# Altium schematic sheet p1_main_ac_dc.SchDoc
size A2; Organization: Protel International P/L; Address1: L3, 12a Rodborough Rd; Address2: Frenchs Forest; Address3: NSW; Address4: Australia 2086
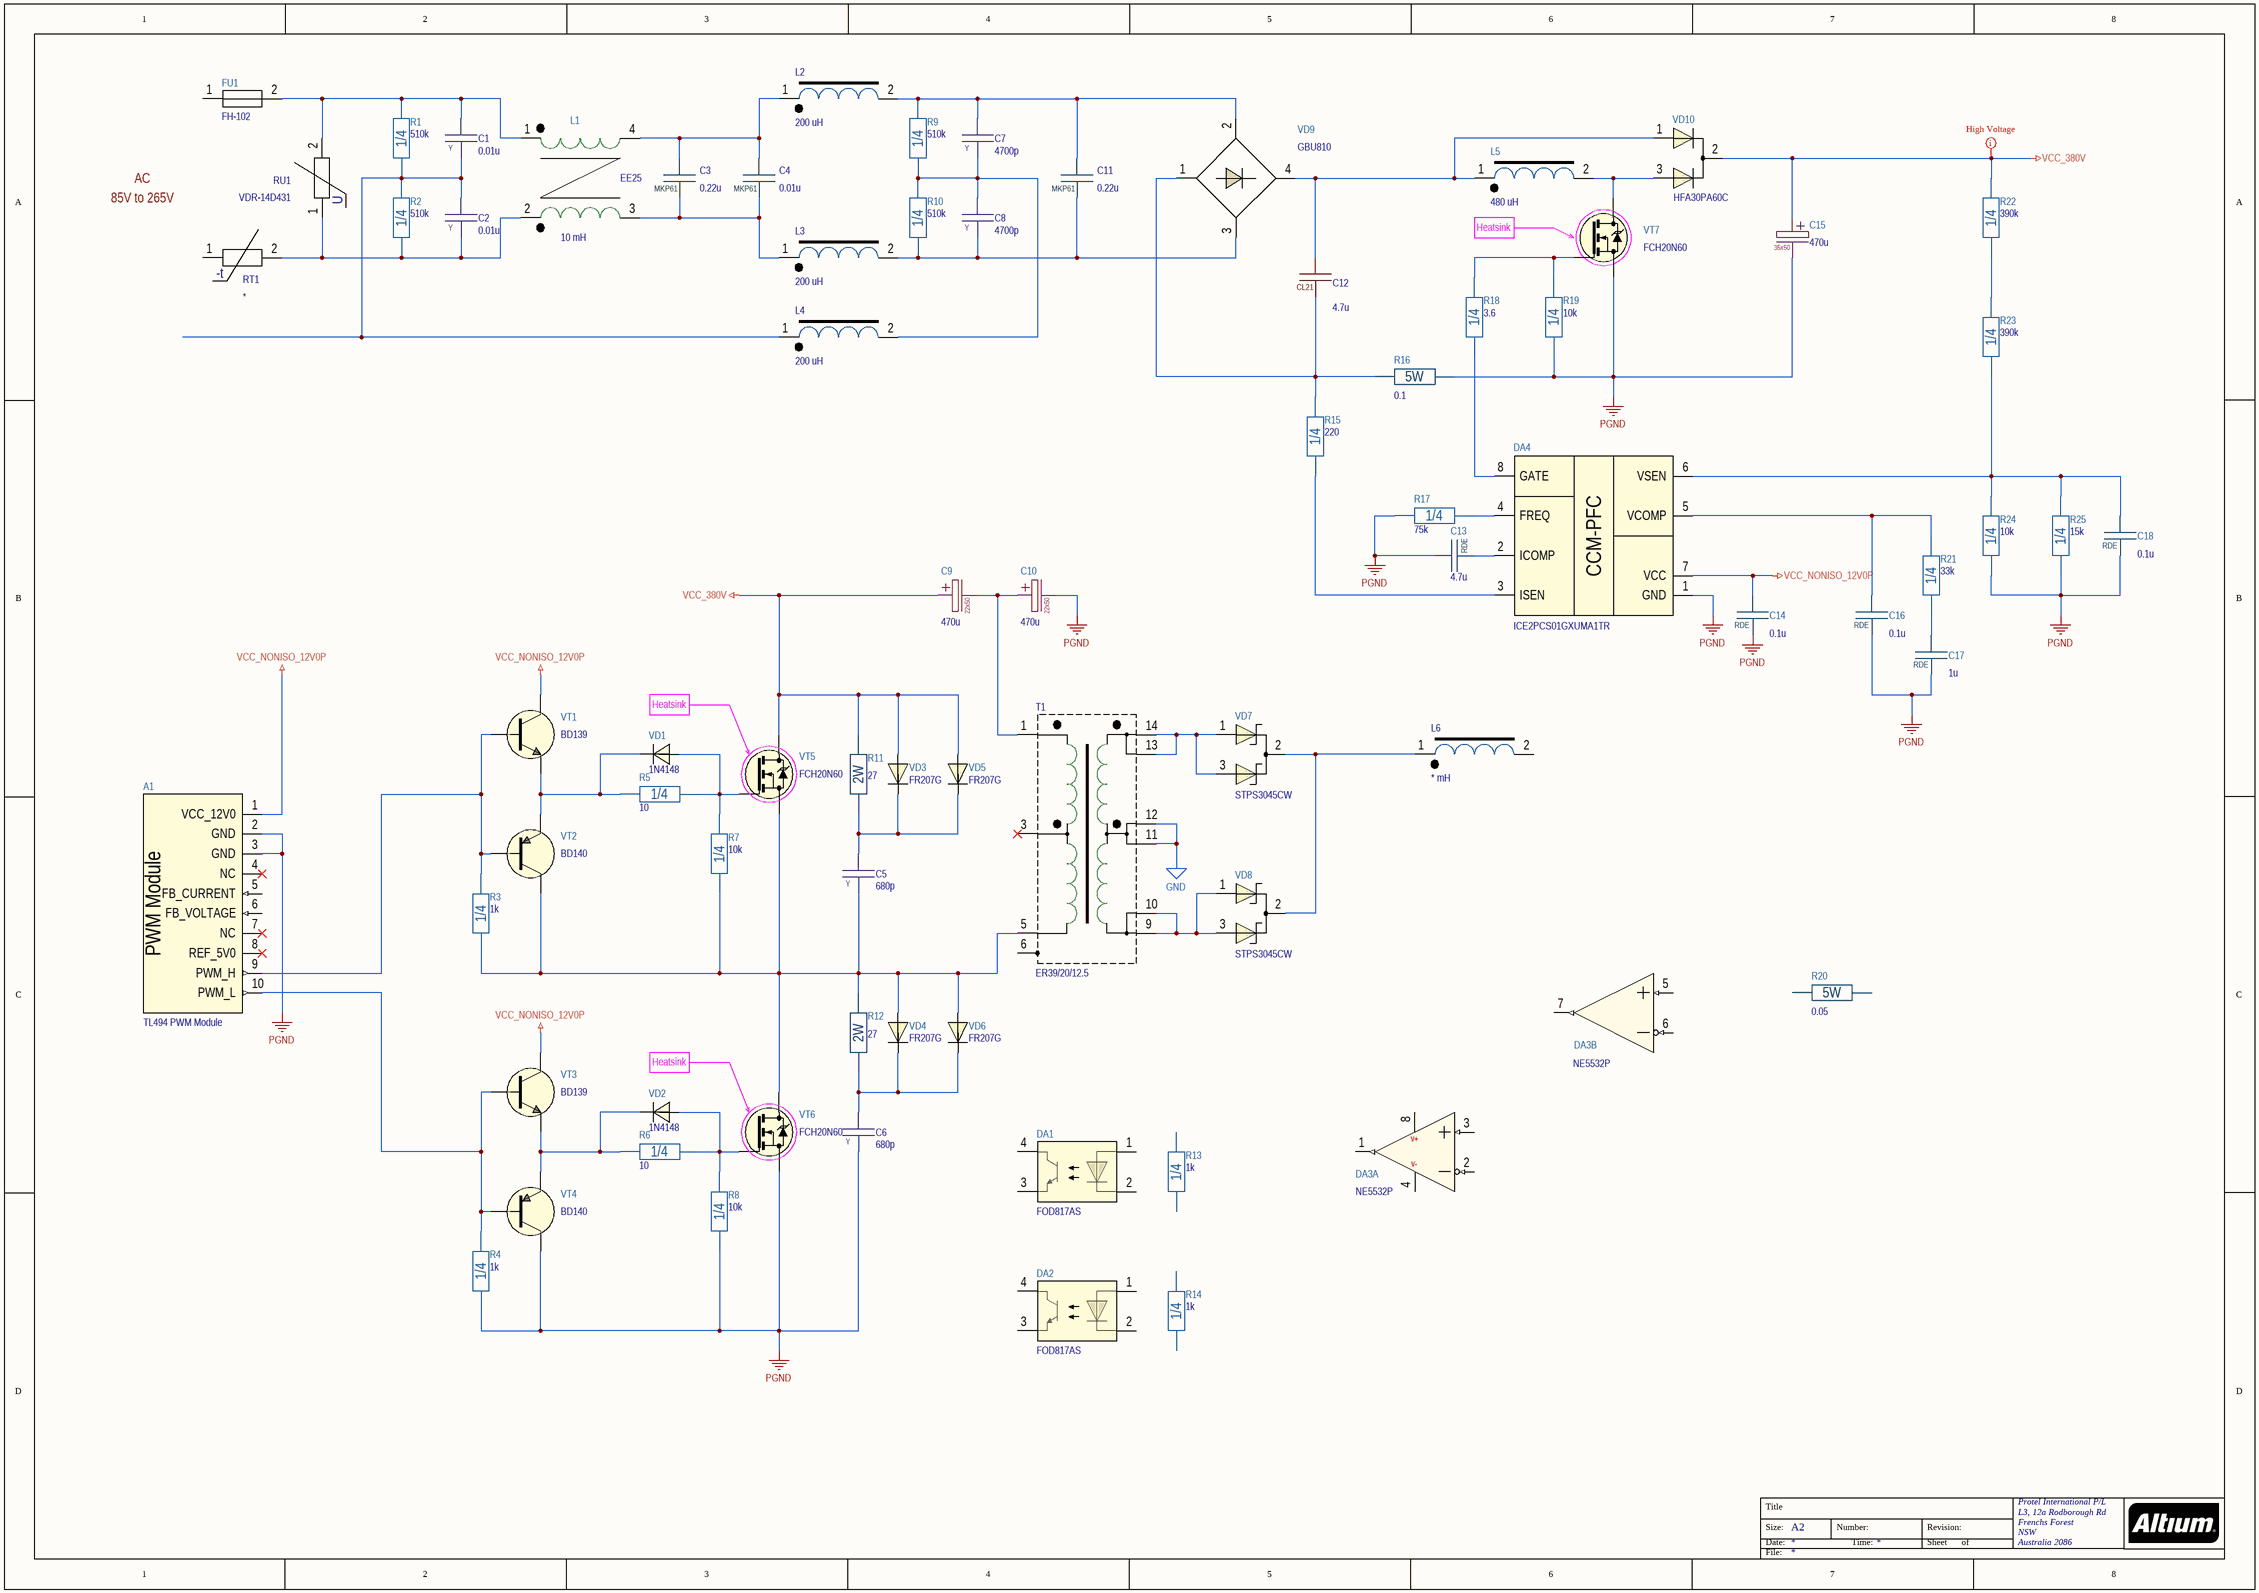
[diagram p0: p1_main_ac_dc.SchDoc]

## Parts
A1  TL494 PWM Module  [PWM-TL494]
C1  0.01u  Package: Y  [JYC_Y2_CAP_6.5]
C2  0.01u  Package: Y  [JYC_Y2_CAP_6.5]
C3  0.22u  [MKP61_18x14.5x8.5_P15]
C4  0.01u  [MKP61_18x12x6_P15]
C5  680p  Package: Y  [JYC_Y2_CAP_7.5]
C6  680p  Package: Y  [JYC_Y2_CAP_7.5]
C7  4700p  Package: Y  [JYC_Y2_CAP_6.5]
C8  4700p  Package: Y  [JYC_Y2_CAP_6.5]
C9  470u  Package: 22x50  [ECAP22X50X10]
C10  470u  Package: 22x50  [ECAP22X50X10]
C11  0.22u  [MKP61_18x14.5x8.5_P15]
C12  4.7u  [CL21_29x24.5x14.0_P27.5]
C13  4.7u  Package: RDE  [RDE_2P1]
C14  0.1u  Package: RDE  [RDE_1P1]
C15  470u  Package: 35x50  [ECAP35X50X10]
C16  0.1u  Package: RDE  [RDE_1P1]
C17  1u  Package: RDE  [RDE_2P1]
C18  0.1u  Package: RDE  [RDE_1P1]
DA1  FOD817AS  [N04C]
DA2  FOD817AS  [N04C]
DA3  NE5532P  [DIP-8P-M01]  (parts A,B of 2)
DA4  ICE2PCS01GXUMA1TR  [SOIC-8_with_DIP-8]
FU1  FH-102  [FH-102]
L1  10 mH  [EE25/10/6]
L2  200 uH  [CORE_D20_GB]
L3  200 uH  [CORE_D20_GB]
L4  200 uH  [CORE_D20_GB]
L5  480 uH  [CORE_D36_GB]
L6  * mH  [CORE_D33_GB]
R1  510k  Package: 1/4  [CFR-25]
R2  510k  Package: 1/4  [CFR-25]
R3  1k  Package: 1/4  [CFR-25]
R4  1k  Package: 1/4  [CFR-25]
R5  10  Package: 1/4  [CFR-25(VERTICAL)]
R6  10  Package: 1/4  [CFR-25(VERTICAL)]
R7  10k  Package: 1/4  [CFR-25]
R8  10k  Package: 1/4  [CFR-25]
R9  510k  Package: 1/4  [CFR-25]
R10  510k  Package: 1/4  [CFR-25]
R11  27  Package: 2W  [CFR-200]
R12  27  Package: 2W  [CFR-200]
R13  1k  Package: 1/4  [CFR-25]
R14  1k  Package: 1/4  [CFR-25]
R15  220  Package: 1/4  [CFR-25]
R16  0.1  Package: 5W  [BPR58]
R17  75k  Package: 1/4  [CFR-25]
R18  3.6  Package: 1/4  [CFR-25]
R19  10k  Package: 1/4  [CFR-25]
R20  0.05  Package: 5W  [BPR58]
R21  33k  Package: 1/4  [CFR-25]
R22  390k  Package: 1/4  [CFR-25]
R23  390k  Package: 1/4  [CFR-25]
R24  10k  Package: 1/4  [CFR-25]
R25  15k  Package: 1/4  [CFR-25]
RT1  *  [NTC_D10]
RU1  VDR-14D431  [VARISTOR_14D]
T1  ER39/20/12.5  [ER39/20/12.5]
VD1  1N4148  [DO-35 GLASS LIGHT RED]
VD2  1N4148  [DO-35 GLASS LIGHT RED]
VD3  FR207G  [DO-15]
VD4  FR207G  [DO-15]
VD5  FR207G  [DO-15]
VD6  FR207G  [DO-15]
VD7  STPS3045CW  [TO-247_with_TO-220 (VERTICAL)]
VD8  STPS3045CW  [TO-247_with_TO-220 (VERTICAL)]
VD9  GBU810  [GBU810]
VD10  HFA30PA60C  [TO-247 ((HORIZONTAL, BOTTOM)]
VT1  BD139  [TO-126 (VERTICAL)]
VT2  BD140  [TO-126 (VERTICAL)]
VT3  BD139  [TO-126 (VERTICAL)]
VT4  BD140  [TO-126 (VERTICAL)]
VT5  FCH20N60  [TO-247_with_TO-220 (VERTICAL)]
VT6  FCH20N60  [TO-247_with_TO-220 (VERTICAL)]
VT7  FCH20N60  [TO-247_with_TO-220 (VERTICAL)]

## Nets
GND: T1.11 T1.12
PGND: A1.2(GND) A1.3(GND) C6.1 C10.2 C13.1 C14.2 C15.2 C16.2 C17.2 C18.2 DA4.1(GND) R4.1 R8.1 R16.2 R17.2 R19.1 R24.1 R25.1 VT4.2(C) VT6.3(S) VT7.3(S)
VCC_380V: C9.1 C15.1 R11.2 R22.2 VD3.2(A) VD5.2(A) VD10.2(C) VT5.2(D)
VCC_NONISO_12V0P: A1.1(VCC_12V0) C14.1 DA4.7(VCC) VT1.2(C) VT3.2(C)
NetA1_9: A1.9(PWM_H) R3.2 VT1.1(B) VT2.1(B)
NetA1_10: A1.10(PWM_L) R4.2 VT3.1(B) VT4.1(B)
NetC1_1: C1.1 FU1.2 L1.1 R1.2 RU1.2
NetC1_2: C1.2 C2.1 L4.1 R1.1 R2.2
NetC2_2: C2.2 L1.2 R2.1 RT1.2 RU1.1
NetC3_1: C3.1 C4.1 L1.3 L3.1
NetC3_2: C3.2 C4.2 L1.4 L2.1
NetC5_1: C5.1 R3.1 R7.1 R12.2 T1.5 VD4.2(A) VD6.2(A) VT2.2(C) VT5.3(S) VT6.2(D)
NetC5_2: C5.2 R11.1 VD3.1(C) VD5.1(C)
NetC6_2: C6.2 R12.1 VD4.1(C) VD6.1(C)
NetC7_1: C7.1 C11.2 L2.2 R9.2 VD9.2(AC1)
NetC7_2: C7.2 C8.1 L4.2 R9.1 R10.2
NetC8_2: C8.2 C11.1 L3.2 R10.1 VD9.3(AC2)
NetC9_2: C9.2 C10.1 T1.1
NetC12_1: C12.1 R15.2 R16.1 VD9.1(M)
NetC12_2: C12.2 L5.1 VD9.4(P) VD10.1(A1)
NetC13_2: C13.2 DA4.2(ICOMP)
NetC16_1: C16.1 DA4.5(VCOMP) R21.2
NetC17_1: C17.1 R21.1
NetC18_1: C18.1 DA4.6(VSEN) R23.1 R24.2 R25.2
NetDA4_3: DA4.3(ISEN) R15.1
NetDA4_4: DA4.4(FREQ) R17.1
NetDA4_8: DA4.8(GATE) R18.1
NetL5_2: L5.2 VD10.3(A2) VT7.2(D)
NetL6_1: L6.1 VD7.2(C) VD8.2(C)
NetR5_1: R5.1 R7.2 VD1.2 VT5.1(G)
NetR5_2: R5.2 VD1.1 VT1.3(E) VT2.3(E)
NetR6_1: R6.1 R8.2 VD2.2 VT6.1(G)
NetR6_2: R6.2 VD2.1 VT3.3(E) VT4.3(E)
NetR18_2: R18.2 R19.2 VT7.1(G)
NetR22_1: R22.1 R23.2
NetT1_9: T1.9 T1.10 VD8.1(A1) VD8.3(A2)
NetT1_13: T1.13 T1.14 VD7.1(A1) VD7.3(A2)

Not connected (* = marked no-connect by the designer): A1 4(NC)* 5(FB_CURRENT) 6(FB_VOLTAGE) 7(NC)* 8(REF_5V0)*; DA1 1(ANODE) 2(CATHODE) 3(EMITTER) 4(COLLECTOR); DA2 1(ANODE) 2(CATHODE) 3(EMITTER) 4(COLLECTOR); DA3 1(1OUT) 2(1IN-) 3(1IN+) 4(GND) 5(2IN+) 6(2IN-) 7(2OUT) 8(VCC); FU1 1; L6 2; R13 1 2; R14 1 2; R20 1 2; RT1 1; T1 3* 6

## Layout directives
net class POWER_HIGH_VOLTAGE: VCC_380V

## Notes on the sheet
- 85V to 265V
- AC
- Heatsink
- Title
- Size:
- Date:
- File:
- A2
- Number:
- Time:
- Revision:
- Sheet
- of
- (in symbol ICE2PCS01GXUMA1TR) CCM-PFC
- (in symbol NE5532P, part A) V+; V-
- (in symbol NTC) -t
- (in symbol PWM-MODULE) PWM Module
- (in symbol VARISTOR) U

## Library data of the parts
A1 = PWM-MODULE: Value: TL494 PWM Module
C1 C2 = JB_Y2: High Voltage Ceramic Capacitor; Part Number: JYC3D103MCF; Manufacturer: JB; Tolerance: ± 20 %; Dielectric: Y5V; Voltage: 2000V; Value: 0.01u; Value on schem: 0.01u
C3 C4 C11 = MKP61: Metallized Polypropylene Film Capacitor for high voltage application; Tolerance: ± 10 %; Voltage: 300V; Dielectric: Polypropylene; Part Number: *; Manufacturer: *; Package: MKP61
  C3 C11: Value: 0.22u; Value on schem: 0.22u
  C4: Value: 0.01u; Value on schem: 0.01u
C5 C6 = JB_Y2: High Voltage Ceramic Capacitor; Part Number: JYC3D681KBB; Manufacturer: JB; Tolerance: ± 10 %; Dielectric: Y5P; Voltage: 2000V; Value: 680p; Value on schem: 680p
C7 C8 = JB_Y2: High Voltage Ceramic Capacitor; Part Number: JYC3D472MBF; Manufacturer: JB; Tolerance: ± 20 %; Dielectric: Y5V; Voltage: 2000V; Value: 4700p; Value on schem: 4700p
C9 C10 = ECAP_22x50: Aluminium capacitors 35x50mm; Part Number: UPW2D471MRD; Manufacturer: Nichicon; Tolerance: ± 20 %; Voltage: 200V; Value: 470u; Value on schem: 470u
C12 = CL21: CL21 Type Metallized Polyester Film Capacitor; Tolerance: ± * %; Voltage: 630V; Value: 4.7u; Dielectric: Polyester; Value on schem: 4.7u; Part Number: *; Manufacturer: *; Package: CL21
C13 = RDE_CAP: MLCC radial lead type with epoxy coat (RDE Series); Part Number: RDEC71H475K2P1H03B; Manufacturer: Murata; Tolerance: ± 10 %; Dielectric: X7S; Voltage: 50V; Value: 4.7u; Value on schem: 4.7u
C14 C16 C18 = RDE_CAP: MLCC radial lead type with epoxy coat (RDE Series); Part Number: RDER72A104K1P1H03B; Manufacturer: Murata; Tolerance: ± 10 %; Dielectric: X7R; Voltage: 100V; Value: 0.1u; Value on schem: 0.1u
C15 = ECAP_35x50: Aluminium capacitors 35x50mm; Part Number: LG450M0470BPF-3550; Manufacturer: Yageo; Tolerance: ± 20 %; Voltage: 450V; Value: 470u; Value on schem: 470u
C17 = RDE_CAP: MLCC radial lead type with epoxy coat (RDE Series); Part Number: RDER71H105K2P1H03B; Manufacturer: Murata; Tolerance: ± 10 %; Dielectric: X7R; Voltage: 50V; Value: 1u; Value on schem: 1u
DA1 DA2 = FOD817AS: Optoisolator 5kV transistor; Manufacturer: ON Semiconductor; Package: 4-SMD (4.1 x 9.86 mm); Part Number: FOD817AS
DA3 = NE5532P: DUAL LOW-NOISE OPERATIONAL AMPLIFIERS; Manufacturer: Texas Instruments; Part Number: NE5532P; Package: DIP-8
DA4 = ICE2PCS01GXUMA1TR: PFC Controller in Continuous Conduction Mode; Manufacturer: Infineon; Part Number: ICE2PCS01GXUMA1TR; Package: SOIC-8
FU1 = FH-102: Fuse holder 5.2х20mm; Package: Dragon City; Part Number: FH-102
L1 = EE25: EE25 Ferrite Core inductor; Value: 10 mH; Core: EE25
L2-L4 = CORE_D20: Ferrite Core D20.3/12.7/6.35 mm; Core: D20; Value: 200 uH
L5 = CORE_D36: Ferrite Core D35.8/22.4/10.5 mm; Core: D36; Value: 480 uH
L6 = CORE_D33: Ferrite Core D32.8/20.1/10.7 mm; Core: D33; Value: * mH
R1 R2 R9 R10 = CF25: Resistor 1/4W; Part Number: MFR-25FTF52-510K; Manufacturer: Yageo; Tolerance: ± 1 %; Voltage: 250V; Temperature Coefficient: ±100 ppm/°C; Value: 510k; Value on schem: 510k
R3 R4 R13 R14 = CF25: Resistor 1/4W; Part Number: MFR-25FTF52-1K; Manufacturer: Yageo; Tolerance: ± 1 %; Voltage: 250V; Temperature Coefficient: ±100 ppm/°C; Value: 1k; Value on schem: 1k
R5 R6 = CF25: Resistor 1/4W; Part Number: MFR-25FTF52-10R; Manufacturer: Yageo; Tolerance: ± 1 %; Voltage: 250V; Temperature Coefficient: ±100 ppm/°C; Value: 10; Value on schem: 10
R7 R8 R19 R24 = CF25: Resistor 1/4W; Part Number: MFR-25FTF52-10K; Manufacturer: Yageo; Tolerance: ± 1 %; Voltage: 250V; Temperature Coefficient: ±100 ppm/°C; Value: 10k; Value on schem: 10k
R11 R12 = CF200: Resistor 2W; Part Number: KNP200JB-73-27R; Manufacturer: Yageo; Tolerance: ± 5 %; Voltage: 250V; Temperature Coefficient: ±300 ppm/°C; Value: 27; Value on schem: 27
R15 = CF25: Resistor 1/4W; Part Number: MFR-25FTF52-220R; Manufacturer: Yageo; Tolerance: ± 1 %; Voltage: 250V; Temperature Coefficient: ±100 ppm/°C; Value: 220; Value on schem: 220
R16 = BPR58: Rectangular type metal plate resistors; Part Number: BPR58CR10J; Manufacturer: KOA Speer; Tolerance: ± 5 %; Temperature Coefficient: ±350 /°C; Value: 0.1; Value on schem: 0.1
R17 = CF25: Resistor 1/4W; Part Number: MFR-25FTF52-75K; Manufacturer: Yageo; Tolerance: ± 1 %; Voltage: 250V; Temperature Coefficient: ±100 ppm/°C; Value: 75k; Value on schem: 75k
R18 = CF25: Resistor 1/4W; Part Number: MFR-25FTF52-3R6; Manufacturer: Yageo; Tolerance: ± 1 %; Voltage: 250V; Temperature Coefficient: ±100 ppm/°C; Value: 3.6; Value on schem: 3.6
R20 = BPR58: Rectangular type metal plate resistors; Part Number: BPR58C50LK; Manufacturer: KOA Speer; Tolerance: ± 10 %; Temperature Coefficient: ±350 /°C; Value: 0.05; Value on schem: 0.05
R21 = CF25: Resistor 1/4W; Part Number: MFR-25FTF52-33K; Manufacturer: Yageo; Tolerance: ± 1 %; Voltage: 250V; Temperature Coefficient: ±100 ppm/°C; Value: 33k; Value on schem: 33k
R22 R23 = CF25: Resistor 1/4W; Part Number: MFR-25FTF52-390K; Manufacturer: Yageo; Tolerance: ± 1 %; Voltage: 250V; Temperature Coefficient: ±100 ppm/°C; Value: 390k; Value on schem: 390k
R25 = CF25: Resistor 1/4W; Part Number: MFR-25FTF52-15K; Manufacturer: Yageo; Tolerance: ± 1 %; Voltage: 250V; Temperature Coefficient: ±100 ppm/°C; Value: 15k; Value on schem: 15k
RT1 = NTC: NTC thermistors; Package: *; Part Number: *
RU1 = VARISTOR: Package: *; Part Number: VDR-14D431
T1 = ER39: EE39 Ferrite Core, with footprint for ER35, EE33, EI33 etc.; Value: ER39/20/12.5
VD1 VD2 = 1N4148: High-speed diode; Package: DO-35; Part Number: 1N4148
VD3-VD6 = FR207G: Diode 2A, 1000V Glass Passivated Fast Recovery Rectifiers; Manufacturer: Taiwan Semiconductor Corporation; Package: DO-15; Part Number: FR207G
VD7 VD8 = STPS3045CW: Power Schottky Rectifier Diode 45V, 2x15A; Manufacturer: STMicroelectronics; Package: TO-247AC; Part Number: STPS3045CW
VD9 = GBU810: 8A single phase bridge rectifier; Manufacturer: Diodes Incorporated; Package: GBU; Part Number: GBU810
VD10 = HFA30PA60C: Ultrafast, Soft Recovery Diode 600V, 15A; Manufacturer: Infineon; Package: TO-247AC; Part Number: HFA30PA60C
VT1 VT3 = BD139: General Purpose n-p-n Transistors; Manufacturer: STMicroelectronics; Package: TO-126; Part Number: BD139
VT2 VT4 = BD140: General Purpose p-n-p Transistors; Manufacturer: STMicroelectronics; Package: TO-126; Part Number: BD140
VT5-VT7 = FCH20N60: 600V @ 20A N-Channel MOSFET; Manufacturer: ON Semiconductor; Part Number: FCH20N60; Package: TO-247